# EAGLE design ngptv-lite (EAGLE 8.3.2)
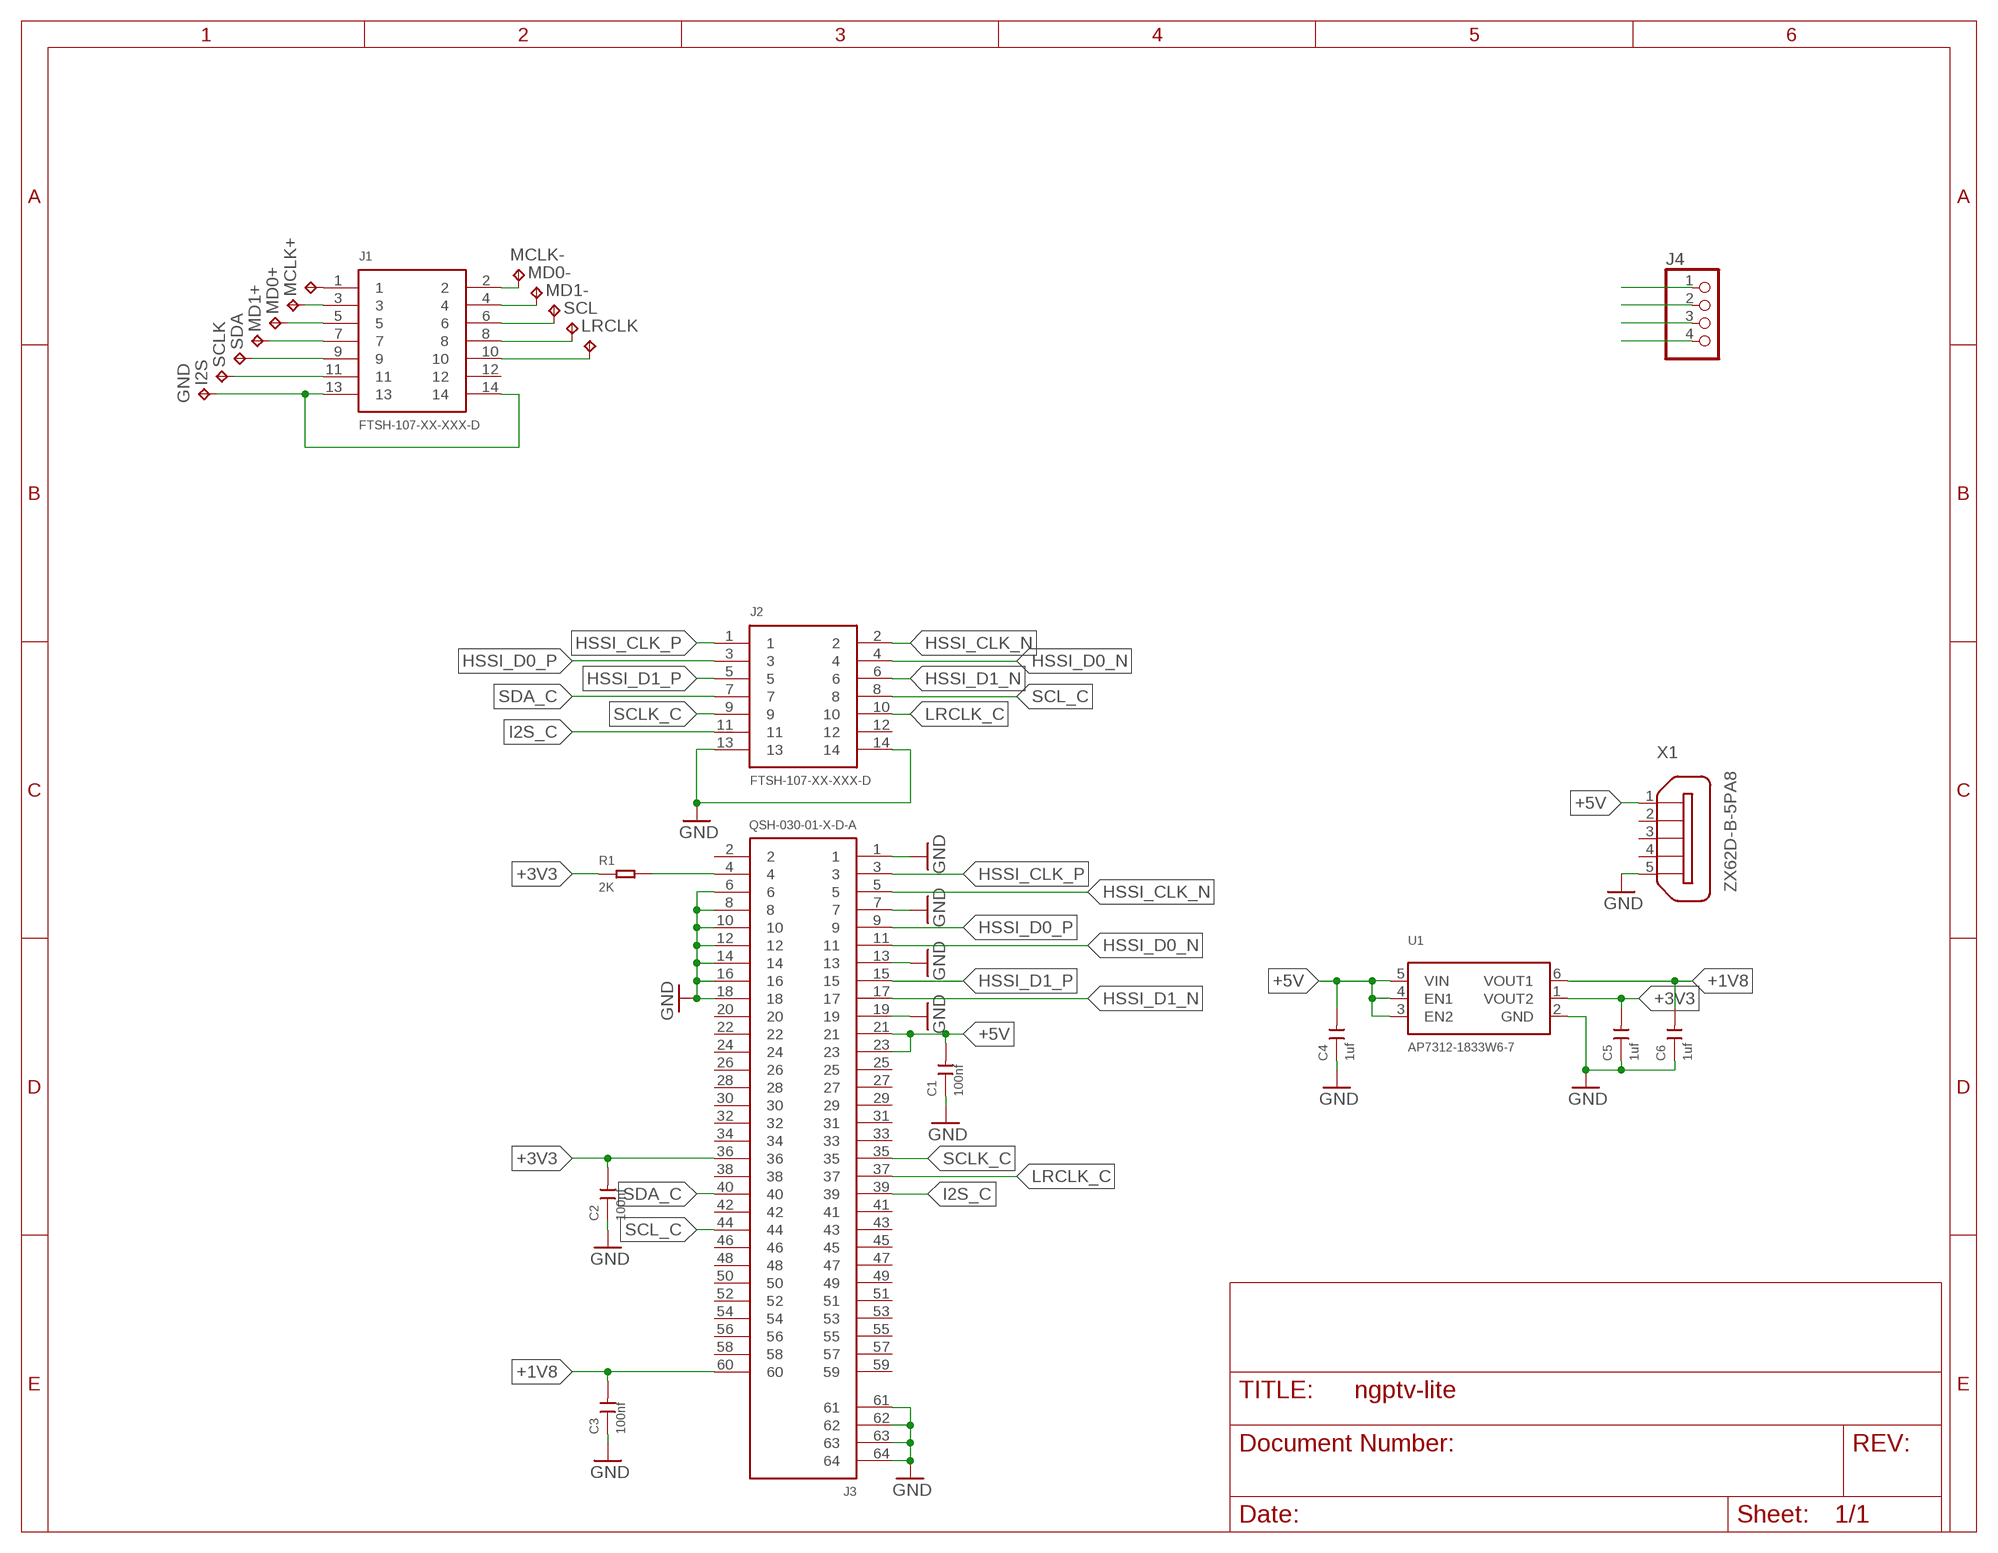
[diagram p0: schematic, sheet 1]

## Parts
C1  100nf  CERAMIC-100NF-50V-10%-X7R(0603)  [C0603]
C2  100nf  CERAMIC-100NF-50V-10%-X7R(0603)  [C0603]
C3  100nf  CERAMIC-100NF-50V-10%-X7R(0603)  [C0603]
C4  1uf  CERAMIC-1UF-25V-10%-X7R(0603)  [C0603]
C5  1uf  CERAMIC-1UF-25V-10%-X7R(0603)  [C0603]
C6  1uf  CERAMIC-1UF-25V-10%-X7R(0603)  [C0603]
GND  TPTP14R  [TP14R]
I2S  TPTP12R  [TP12R]
J1  FTSH-107-XX-XXX-D  [FTSH-107-XX-XXX-D]
J2  FTSH-107-XX-XXX-D  [FTSH-107-XX-XXX-D]
J3  QSH-030-01-X-D-A  [QSH-030-01-X-D-A]
J4  PINHD-1X4  [1X04]
LRCLK  TPTP12R  [TP12R]
MCLK+  TPTP12R  [TP12R]
MCLK-  TPTP12R  [TP12R]
MD0+  TPTP12R  [TP12R]
MD0-  TPTP12R  [TP12R]
MD1+  TPTP12R  [TP12R]
MD1-  TPTP12R  [TP12R]
R1  2K  SMD-RES-2K-1%-1/10W(0603)  [R0603]
SCL  TPTP12R  [TP12R]
SCLK  TPTP12R  [TP12R]
SDA  TPTP12R  [TP12R]
U1  AP7312-1833W6-7  AP7312  [SOT95P280X145-6N]
X1  ZX62D-B-5PA8  [ZX62D-B-5PA8]

## Nets
+1V8: C3.2 C6.2 J3.60 U1.6(VOUT1)
+3V3: C2.2 C5.2 J3.36 R1.1 U1.1(VOUT2)
+5V: C1.2 C4.2 J3.21 J3.23 J4.1 U1.3(EN2) U1.4(EN1) U1.5(VIN) X1.1
GND: C1.1 C2.1 C3.1 C4.1 C5.1 C6.1 J2.13 J2.14 J3.1 J3.6 J3.7 J3.8 J3.10 J3.12 J3.13 J3.14 J3.16 J3.18 J3.19 J3.61 J3.62 J3.63 J3.64 J4.2 U1.2(GND) X1.5
GND_H: GND.TP J1.13 J1.14
HSSI_CLK_N: J2.2 J3.5
HSSI_CLK_P: J2.1 J3.3
HSSI_D0_N: J2.4 J3.11
HSSI_D0_P: J2.3 J3.9
HSSI_D1_N: J2.6 J3.17
HSSI_D1_P: J2.5 J3.15
I2S: I2S.TP J1.11
I2S_C: J2.11 J3.39
INT: J3.4 R1.2
LRCLK: J1.10 LRCLK.TP
LRCLK_C: J2.10 J3.37
MCLK_N: J1.2 MCLK-.TP
MCLK_P: J1.1 MCLK+.TP
MD0_N: J1.4 MD0-.TP
MD0_P: J1.3 MD0+.TP
MD1_N: J1.6 MD1-.TP
MD1_P: J1.5 MD1+.TP
SCL: J1.8 SCL.TP
SCL_C: J2.8 J3.44 J4.4
SCLK: J1.9 SCLK.TP
SCLK_C: J2.9 J3.35
SDA: J1.7 SDA.TP
SDA_C: J2.7 J3.40 J4.3
Unconnected: J1.12 J2.12 J3.2 J3.20 J3.22 J3.24 J3.25 J3.26 J3.27 J3.28 J3.29 J3.30 J3.31 J3.32 J3.33 J3.34 J3.38 J3.41 J3.42 J3.43 J3.45 J3.46 J3.47 J3.48 J3.49 J3.50 J3.51 J3.52 J3.53 J3.54 J3.55 J3.56 J3.57 J3.58 J3.59 X1.2 X1.3 X1.4 X1.S1 X1.S2 X1.S3 X1.S4

## Library data of the parts
C1-C3 = Seeed-Capacitor:CERAMIC-100NF-50V-10%-X7R(0603): 302010138; MPN: CC0603KRX7R9BB104
C4-C6 = Seeed-Capacitor:CERAMIC-1UF-25V-10%-X7R(0603): 302010139; MPN: CC0603KRX7R8BB105
GND I2S LRCLK MCLK+ MCLK- MD0+ MD0- MD1+ MD1- SCL SCLK SDA = testpad:TP: Test pad
J1 J2 = FTSH-107-XX-XXX-D:FTSH-107-XX-XXX-D: 0.050"X0.050" CL THROUGH HOLE TERMINAL STRIP ASSEMBLY,14PINS.
J3 = QSH-030-01-X-D-A:QSH-030-01-X-D-A: HIGH SPEED SOCKET STRIP, .5mm PITCH, 60 PINS. MANUFACTURER:SAMTEC.
J4 = pinhead:PINHD-1X4: PIN HEADER
R1 = Seeed-Resistor:SMD-RES-2K-1%-1/10W(0603): 301010221; MPN: RC0603FR-072KL
U1 = AP7312:AP7312
X1 = zx62d-b-5pa8-oshpark_10:ZX62D-B-5PA8: Micro USB Type B Connector - Standard, Shell Through Hole Source: http://www.hirose.co.jp/cataloge_hp/ed_ZX_20140804.pdf; MF: Hirose; MPN: ZX62D-B-5PA8; OC_FARNELL: 2300438; OC_NEWARK: 69W0712

## Board
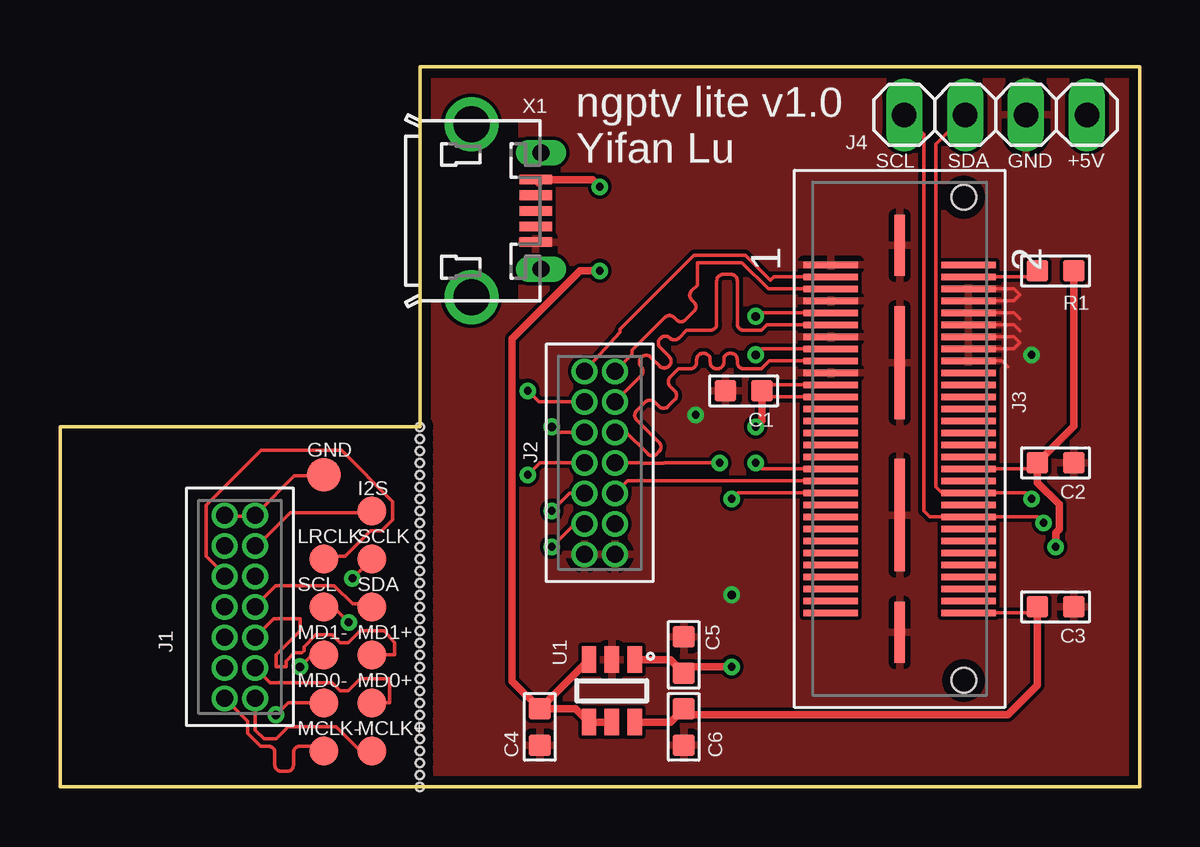
[diagram p1: board, top side]
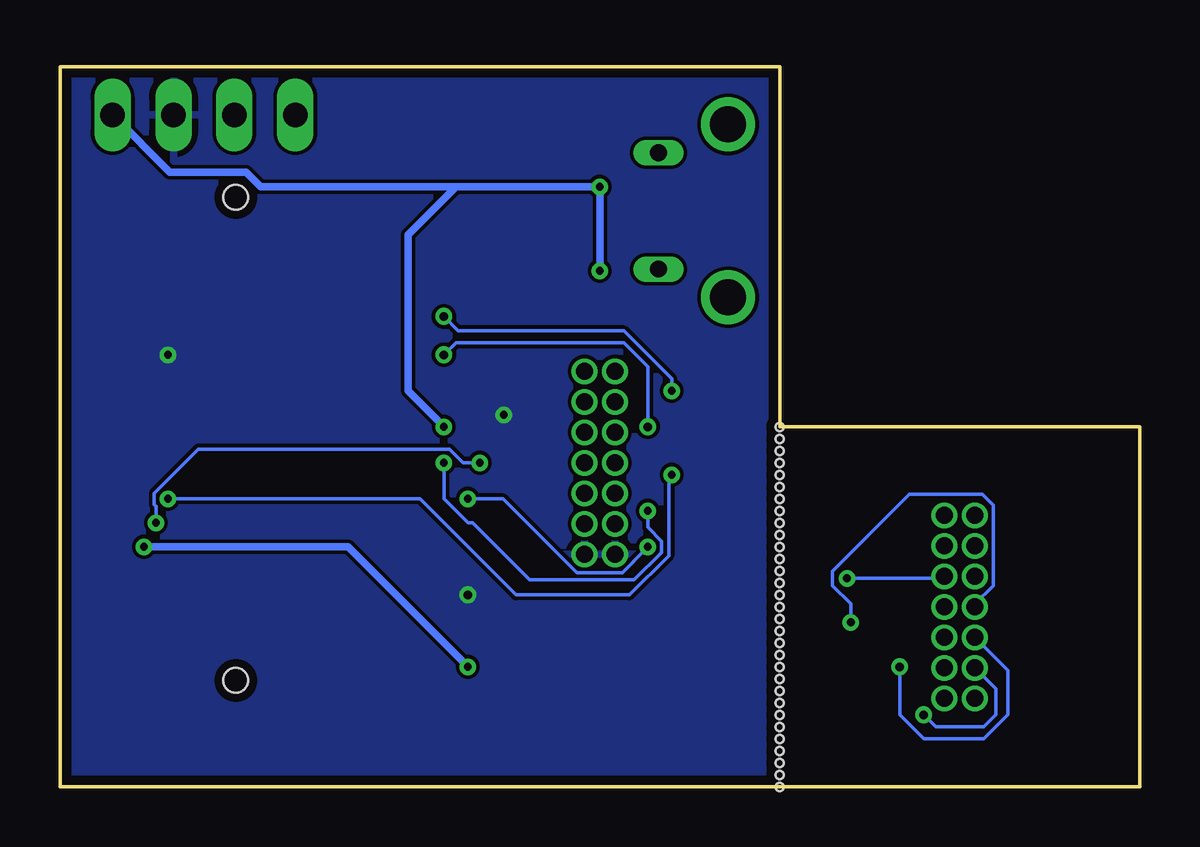
[diagram p2: board, bottom side, seen from below]

Size 45 x 30 mm. Coordinates in mm from the lower left corner, seen from the top.
Outline: 0,0 45,0 45,30 15,30 15,15 0,15 0,0
Copper layers (1*16): Top 0.0356mm / dielectric 1.5011mm / Bottom 0.0356mm
Design rules "oshpark-2layer *": minimum track width 6mil, minimum drill 13mil, track to track 6mil, track to pad 6mil, pad to pad 6mil, via to via 6mil, smd to smd 0mil, copper to edge 15mil, drill to drill 6mil, minimum pad ring 7mil, minimum via ring 7mil, stop-mask expansion 2.5mil, vias tented up to drill 0mil, thermal gap 10mil
Holes 0.33 mm at 15,15 15,14.5 15,14 15,13.5 15,13 15,12.5 15,12 15,11.5 15,11 15,10.5 15,10 15,9.5 15,9 15,8.5 15,8 15,7.5 15,7 15,6.5 15,6 15,5.5 15,5 15,4.5 15,4 15,3.5 15,3 15,2.5 15,2 15,1.5 15,1 15,0.5 15,0

### Footprints (pad centres in the part's own frame; a part is rotated, then mirrored left to right if it is on the bottom)
C0603 = smd 0.889 x 0.889: 1 0,0.762; 2 0,-0.762
TP14R = smd 1.4 x 1.4: TP 0,0
TP12R = smd 1.2 x 1.2: TP 0,0
FTSH-107-XX-XXX-D = drill 0.711 pad 1.016: 1 -3.81,-0.635; 2 -3.81,0.635; 3 -2.54,-0.635; 4 -2.54,0.635; 5 -1.27,-0.635; 6 -1.27,0.635; 7 0,-0.635; 8 0,0.635; 9 1.27,-0.635; 10 1.27,0.635; 11 2.54,-0.635; 12 2.54,0.635; 13 3.81,-0.635; 14 3.81,0.635
QSH-030-01-X-D-A = smd 0.28 x 2.27: 1 -7.25,-2.87; 2 -7.25,2.87; 3 -6.75,-2.87; 4 -6.75,2.87; 5 -6.25,-2.87; 6 -6.25,2.87; 7 -5.75,-2.87; 8 -5.75,2.87; 9 -5.25,-2.87; 10 -5.25,2.87; 11 -4.75,-2.87; 12 -4.75,2.87; 13 -4.25,-2.87; 14 -4.25,2.87; 15 -3.75,-2.87; 16 -3.75,2.87; 17 -3.25,-2.87; 18 -3.25,2.87; 19 -2.75,-2.87; 20 -2.75,2.87; 21 -2.25,-2.87; 22 -2.25,2.87; 23 -1.75,-2.87; 24 -1.75,2.87; 25 -1.25,-2.87; 26 -1.25,2.87; 27 -0.75,-2.87; 28 -0.75,2.87; 29 -0.25,-2.87; 30 -0.25,2.87; 31 0.25,-2.87; 32 0.25,2.87; 33 0.75,-2.87; 34 0.75,2.87; 35 1.25,-2.87; 36 1.25,2.87; 37 1.75,-2.87; 38 1.75,2.87; 39 2.25,-2.87; 40 2.25,2.87; 41 2.75,-2.87; 42 2.75,2.87; 43 3.25,-2.87; 44 3.25,2.87; 45 3.75,-2.87; 46 3.75,2.87; 47 4.25,-2.87; 48 4.25,2.87; 49 4.75,-2.87; 50 4.75,2.87; 51 5.25,-2.87; 52 5.25,2.87; 53 5.75,-2.87; 54 5.75,2.87; 55 6.25,-2.87; 56 6.25,2.87; 57 6.75,-2.87; 58 6.75,2.87; 59 7.25,-2.87; 60 7.25,2.87 | smd 2.54 x 0.43: 61 -8.065,0; 64 8.065,0 | smd 4.7 x 0.43: 62 -3.175,0; 63 3.175,0 | hole 1.02: -10.065,2.67; 10.065,2.67
1X04 = drill 1.016 long: 1 -3.81,0; 2 -1.27,0; 3 1.27,0; 4 3.81,0
R0603 = smd 0.889 x 0.889: 1 0,0.762; 2 0,-0.762
SOT95P280X145-6N = smd 1.1 x 0.6: 1 -1.3,0.95; 2 -1.3,0; 3 -1.3,-0.95; 4 1.3,-0.95; 5 1.3,0; 6 1.3,0.95
ZX62D-B-5PA8 = smd 1.35 x 0.4: 1 4.825,1.3; 2 4.825,0.65; 3 4.825,0; 4 4.825,-0.65; 5 4.825,-1.3 | drill 1.5: S1 2.15,-3.6; S2 2.15,3.6 | drill 0.7 long: S3 5.05,2.425; S4 5.05,-2.425

### Placement (x,y rotation side)
C1  28.5,16.5 90 top
C2  41.5,13.5 270 top
C3  41.5,7.5 270 top
C4  20,2.5 180 top
C5  26,5.5 0 top
C6  26,2.5 180 top
GND  11,13 0 top
I2S  13,11.5 0 top
J1  7.5,7.5 90 top
J2  22.5,13.5 270 top
J3  35,14.5 270 top
J4  39,28 180 top
LRCLK  11,9.5 0 top
MCLK+  13,1.5 0 top
MCLK-  11,1.5 0 top
MD0+  13,3.5 0 top
MD0-  11,3.5 0 top
MD1+  13,5.5 0 top
MD1-  11,5.5 0 top
R1  41.5,21.5 270 top
SCL  11,7.5 0 top
SCLK  13,9.5 0 top
SDA  13,7.5 0 top
U1  23,4 270 top
X1  15,24 0 top

### Tracks (layer width: path | path; a pad name or v marks a point on that pad's centre or on a via)
+1V8
  Top 0.152: C3.2 40.49,7.25 J3.60
  Top 0.305: U1.6 25.44,2.7 C6.2 26.26,3 39.5,3 40.74,4.24 C3.2
+3V3  (via drill 0.33)
  Top 0.152: C2.2 40.49,13.25 J3.36
  Top 0.305: U1.1 25.44,5.3 C5.2 26.26,5 v28,5 | v41.5,10 41.5,10.58 41.65,10.73 41.65,11.77 40.74,12.68 C2.2 42.26,15.02 R1.1
  Bottom 0.305: v28,5 33,10 v41.5,10
+5V  (via drill 0.33)
  Top 0.152: J3.23 29.51,16.25 C1.2 29.51,16.75 J3.21
  Top 0.305: C4.2 21.49,3.26 U1.4 U1.5 | U1.3 20.01,3.26 C4.2 | 19.97,25.16 X1.1 22.2,25.3 v22.5,25 | C4.2 18.85,4.41 18.85,18.67 21.68,21.5 v22.5,21.5 | v29,15 29.26,15.26 C1.2
  Bottom 0.305: v29,15 30.5,16.5 30.5,23 28.5,25 v22.5,25 | v22.5,21.5 v22.5,25 | v22.5,25 36.63,25 37.24,25.61 40.42,25.61 J4.1
GND  (via drill 0.33, 0.35)
  Top 0.152: J3.18 39.25,17.75 39.5,17.5 | J3.16 39.75,18.25 40,18.5 39.75,18.75 J3.14 | J3.12 39.75,19.25 40,19 | J3.10 39.75,19.75 40,19.5 | J3.8 39.75,20.25 40,20.5 39.75,20.75 J3.6
  other vias: 26.5,15.5 40.5,18 28,8
  pour Top: 15.5,30 15.5,0 45,0 45,30
  pour Bottom: 15.5,30 15.5,0 45,0 45,30
GND_H
  Top 0.152: GND.TP 10.97,12.95 9.75,12.95 8.23,11.43 J1.13 8.08,11.28 7.01,11.28 J1.14
HSSI_CLK_N
  Top 0.152: J3.5 29.53,20.75 28.44,21.85 26.56,21.85 26.56,20.91 26.33,20.67 arc90 26.33,20.3 26.43,20.19 arc-90 26.43,19.82 26.07,19.46 arc-90 25.7,19.46 25.59,19.56 arc90 25.22,19.56 23.84,18.19 23.84,18.02 J2.2
HSSI_CLK_P
  Top 0.152: J2.1 23.35,18.95 23.35,19.06 26.44,22.15 28.56,22.15 29.61,21.11 29.75,21.25 J3.3
HSSI_D0_N
  Top 0.152: J3.11 29.47,19.25 29.24,19.02 28.5,19.02 arc-90 28.23,19.29 28.23,21.09 arc90 27.97,21.36 27.64,21.36 arc90 27.37,21.09 27.37,19.29 arc-90 27.11,19.02 26.11,19.02 25.8,18.7 arc-90 25.42,18.7 arc90 25.04,18.7 25.02,18.68 arc90 25.02,18.3 25.4,17.93 arc-90 25.4,17.55 25.38,17.53 arc-90 25,17.53 24.62,17.91 arc90 24.25,17.91 24.23,17.89 arc90 24.23,17.51 arc-90 24.23,17.13 J2.4
HSSI_D0_P  (via drill 0.33, 0.35)
  Top 0.152: v19.5,16.5 19.96,16.04 J2.3 | v29,19.6 29.15,19.75 J3.9
  Bottom 0.152: v19.5,16.5 19.5,17 21.5,19 28.4,19 v29,19.6
HSSI_D1_N
  Top 0.152: J3.17 29.57,17.75 29.24,17.42 28.5,17.42 arc-90 28.23,17.68 28.23,17.8 arc90 27.97,18.07 27.93,18.07 arc90 27.67,17.8 27.67,17.68 arc-90 27.4,17.42 27.37,17.42 arc-90 27.1,17.68 27.1,17.8 arc90 26.84,18.07 26.8,18.07 arc90 26.54,17.8 26.54,17.68 arc-90 26.27,17.42 25.78,17.42 25.43,17.07 arc90 25.43,16.69 25.62,16.5 arc-90 25.62,16.12 25.35,15.85 arc-90 24.97,15.85 24.78,16.04 arc90 24.41,16.04 24.04,15.67 arc90 24.04,15.29 24.98,14.35 arc-90 24.98,13.98 24.88,13.88 arc-90 24.5,13.88 23.56,14.82 arc90 23.18,14.82 J2.6
HSSI_D1_P  (via drill 0.35)
  Top 0.152: J2.5 20.73,14.77 v20.5,15 | v29,18 29.25,18.25 J3.15
  Bottom 0.152: v20.5,15 20.5,17.5 21.5,18.5 28.5,18.5 v29,18
I2S
  Top 0.152: I2S.TP 12.95,11.43 9.6,11.43 8.23,10.06 J1.11
I2S_C  (via drill 0.33)
  Top 0.152: J2.11 21.46,10.96 v20.5,10 | v28,12 28.25,12.25 J3.39
  Bottom 0.152: v28,12 26.52,12 23.45,8.93 21.55,8.93 21.1,9.37 21.1,9.4 v20.5,10
INT
  Top 0.152: R1.2 40.49,21.25 J3.4
LRCLK
  Top 0.152: LRCLK.TP 11.12,9.6 11.89,9.6 12.95,10.67 13.41,10.67 13.87,11.12 13.87,11.89 11.73,14.02 8.38,14.02 6.1,11.73 6.1,9.6 6.86,8.84 J1.10
LRCLK_C
  Top 0.152: J2.10 23.66,12.75 J3.37
MCLK_N
  Top 0.152: MCLK-.TP 10.8,1.7 10,1.7 arc90 9.73,1.43 9.73,0.92 arc-90 9.47,0.65 9.22,0.65 arc-90 8.96,0.92 8.96,1.43 arc90 8.69,1.7 8.37,1.7 7.83,2.24 7.83,2.73 J1.2
MCLK_P
  Top 0.152: MCLK+.TP 12.5,1.5 11.5,2.5 9.5,2.5 9,2 8.5,2 8.13,2.37 J1.1
MD0_N  (via drill 0.35)
  Top 0.152: MD0-.TP 9.5,3.5 v9,3
  Bottom 0.152: v9,3 8.5,2.5 6.5,2.5 6,3 6,4.09 J1.4
MD0_P
  Top 0.152: J1.3 8.77,4.33 11.34,4.33 11.67,4 12,4 12.5,4.5 13.74,4.5 13.74,3.5 MD0+.TP
MD1_N  (via drill 0.35)
  Top 0.152: MD1-.TP 10.5,5.5 v10,5
  Bottom 0.152: v10,5 10,3 9,2 6.5,2 5.5,3 5.5,4.87 J1.6
MD1_P
  Top 0.152: MD1+.TP 13.95,5.5 13.95,6 13.5,6.5 12.5,6.5 12,6 11.67,6 11.34,6.33 10.66,6.33 10.17,5.84 10.17,5.67 10.08,5.58 9.76,5.58 9.42,5.24 9.42,5 9,5 9,5.5 10,6.5 10,7 8.9,7 J1.5
SCL  (via drill 0.33)
  Top 0.152: v12.04,6.86 11.43,7.47 11.12,7.47 SCL.TP
  Bottom 0.152: v12.04,6.86 12.04,7.62 12.8,8.38 12.8,8.99 9.6,12.19 6.55,12.19 6.1,11.73 6.1,8.38 6.86,7.62 J1.8
SCL_C  (via drill 0.33)
  Top 0.152: J2.8 24.19,13.5 24.2,13.49 25.18,13.49 25.19,13.5 v27.5,13.5 | v41,11 40.75,11.25 J3.44 36.25,11.25 36,11.5 36,27.19 J4.4
  Bottom 0.152: v27.5,13.5 28.19,13.5 28.76,14.07 39.24,14.07 41.07,12.24 41.07,11.76 41,11.69 v41,11
SCLK  (via drill 0.33)
  Top 0.152: v12.19,8.69 12.95,9.45 SCLK.TP
  Bottom 0.152: v12.19,8.69 8.23,8.69 J1.9
SCLK_C  (via drill 0.33)
  Top 0.152: J2.9 21.23,12.23 v20.5,11.5 | v29,13.5 29.25,13.25 J3.35
  Bottom 0.152: v20.5,11.5 20.5,10.81 19.93,10.24 19.93,9.76 21.07,8.62 25.43,8.62 27.81,11 28,11 29,12 v29,13.5
SDA
  Top 0.152: SDA.TP 12.95,7.62 12.19,7.62 11.43,8.38 8.99,8.38 8.23,7.62 J1.7
SDA_C  (via drill 0.33)
  Top 0.152: J2.7 20,13.5 v19.5,13 | v40.5,12 40.25,12.25 J3.40 36.75,12.25 36.5,12.5 36.5,26.77 J4.3
  Bottom 0.152: v19.5,13 19.62,12.88 19.62,9.64 21.26,8 26,8 30,12 v40.5,12

### Text on the board
tPlace: ngptv lite v1.0 / Yifan Lu | SCL | SDA | GND | +5V